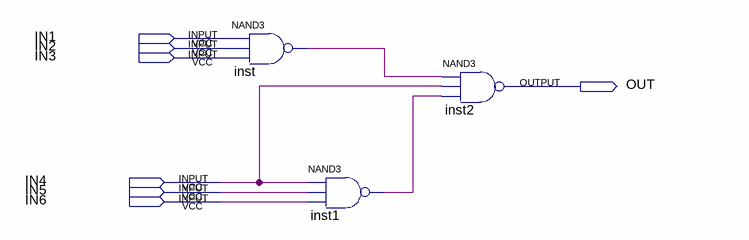
[diagram p0: schematic sheet]
// Quartus schematic teste.bdf as structural Verilog: 3 symbols, 7 pins
module teste (
  input  IN1,
  input  IN2,
  input  IN3,
  input  IN4,
  input  IN5,
  input  IN6,
  output OUT
);

  wire inst1_out, inst_out;

  nand inst (inst_out, IN1, IN2, IN3);
  nand inst1 (inst1_out, IN4, IN5, IN6);
  nand inst2 (OUT, inst_out, IN4, inst1_out);
endmodule
